# EAGLE schematic RS485_Breakout (EAGLE 9.1.3)
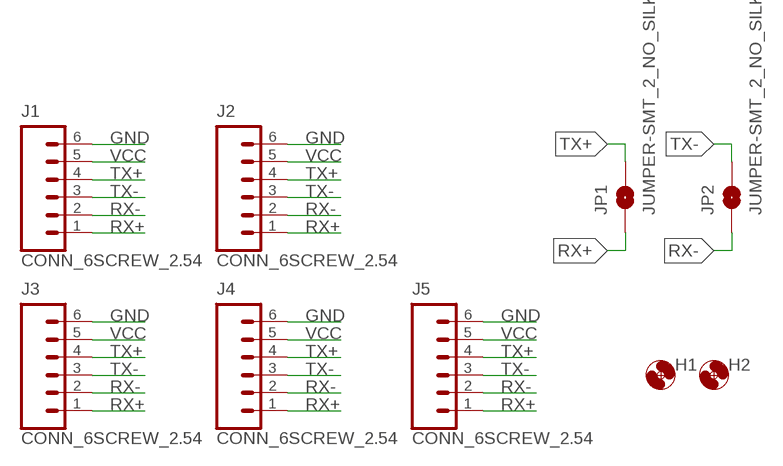
[diagram p0: schematic, sheet 1]

## Parts
H1  MOUNTING_HOLE4_NP  [4_40]
H2  MOUNTING_HOLE4_NP  [4_40]
J1  CONN_6SCREW_2.54  [1X06_SCREW]
J2  CONN_6SCREW_2.54  [1X06_SCREW]
J3  CONN_6SCREW_2.54  [1X06_SCREW]
J4  CONN_6SCREW_2.54  [1X06_SCREW]
J5  CONN_6SCREW_2.54  [1X06_SCREW]
JP1  JUMPER-SMT_2_NO_SILK  [SMT-JUMPER_2_NO_SILK]
JP2  JUMPER-SMT_2_NO_SILK  [SMT-JUMPER_2_NO_SILK]

## Nets
GND [Power]: J1.6 J2.6 J3.6 J4.6 J5.6
RX+ [Signal]: J1.1 J2.1 J3.1 J4.1 J5.1 JP1.1
RX- [Signal]: J1.2 J2.2 J3.2 J4.2 J5.2 JP2.1
TX+ [Signal]: J1.4 J2.4 J3.4 J4.4 J5.4 JP1.2
TX- [Signal]: J1.3 J2.3 J3.3 J4.3 J5.3 JP2.2
VCC [Power]: J1.5 J2.5 J3.5 J4.5 J5.5

## Library data of the parts
H1 H2 = bschulz:MOUNTING_HOLE: Genaric Mechanical Mounting Hole Hole diameter based on max body diameter + 15% Keepout ring is for diameter of socket cap screw (minimum required clearance) TPlace ring is for diameter of pan head screw (recomended clearance) Specifications: Socket Cap <http://fastener-express.com/fastener-technical/SocketscapSS-Alloy.pdf> Button Head Socket Cap <http://fastener-express.com/fastener-technical/Button-Socket-alloy.pdf> Pan Head <http://fastener-express.com/fastener-technical/pan-machine-Screws.pdf>
J1-J5 = bschulz:CONN_6: Genaric 6 pin header; DIGIKEY: ED10565-ND; MF: OnShore; MPN: OSTVN06A150
JP1 JP2 = SparkFun-Jumpers:JUMPER-SMT_2_NO: Normally open jumper This jumper has two pads in close proximity to each other. Apply solder to close the connection. Round pads are easier to solder for beginners, but are a lot larger. SparkFun Product that uses the round pads: SparkFun EL Sequencer <https://www.sparkfun.com/products/12781>

## Net classes
1 Power: width 0.406 mm
2 Signal: width 0.254 mm